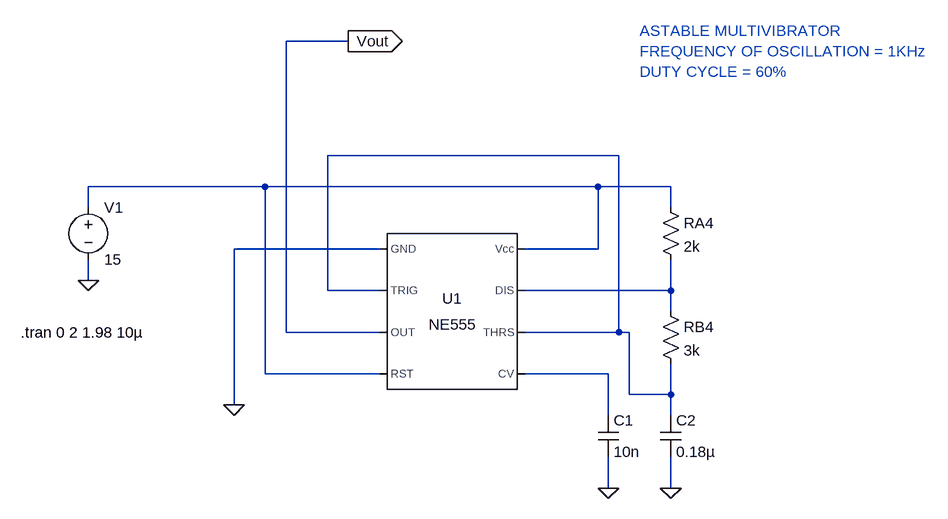
[diagram p0: schematic astable_multivibrator.asc]
astable_multivibrator.asc, the LTspice schematic file:
Version 4
SHEET 1 920 680
WIRE -32 -128 -128 -128
WIRE 384 48 -64 48
WIRE -160 96 -432 96
WIRE 352 96 -160 96
WIRE 464 96 352 96
WIRE -432 128 -432 96
WIRE 464 128 464 96
WIRE 16 192 -208 192
WIRE 352 192 352 96
WIRE 352 192 240 192
WIRE -432 240 -432 208
WIRE -64 256 -64 48
WIRE 16 256 -64 256
WIRE 464 256 464 208
WIRE 464 256 240 256
WIRE 464 288 464 256
WIRE -128 320 -128 -128
WIRE 16 320 -128 320
WIRE 384 320 384 48
WIRE 384 320 240 320
WIRE 400 320 384 320
WIRE -160 384 -160 96
WIRE 16 384 -160 384
WIRE 368 384 240 384
WIRE 400 416 400 320
WIRE 464 416 464 368
WIRE 464 416 400 416
WIRE -208 432 -208 192
WIRE 368 448 368 384
WIRE 464 448 464 416
WIRE 368 560 368 512
WIRE 464 560 464 512
FLAG -208 432 0
FLAG -432 240 0
FLAG 368 560 0
FLAG 464 560 0
FLAG -32 -128 Vout
IOPIN -32 -128 Out
SYMBOL NE555 128 288 R0
SYMATTR InstName U1
SYMBOL cap 352 448 R0
SYMATTR InstName C1
SYMATTR Value 10n
SYMBOL cap 448 448 R0
SYMATTR InstName C2
SYMATTR Value 0.18µ
SYMBOL res 448 112 R0
SYMATTR InstName RA4
SYMATTR Value 2k
SYMBOL res 448 272 R0
SYMATTR InstName RB4
SYMATTR Value 3k
SYMBOL voltage -432 112 R0
WINDOW 123 0 0 Left 0
WINDOW 39 0 0 Left 0
SYMATTR InstName V1
SYMATTR Value 15
TEXT -536 320 Left 2 !.tran 0 2 1.98 10µ
TEXT 416 -144 Left 2 ;ASTABLE MULTIVIBRATOR\nFREQUENCY OF OSCILLATION = 1KHz\nDUTY CYCLE = 60%

The netlist it stands for:
* astable_multivibrator.asc
XU1 0 N001 Vout N002 N004 N001 N003 N002 NE555  ; pins GND TRIG OUT RST CV THRS DIS Vcc
C1 N004 0 10n
C2 N001 0 0.18µ
RA4 N002 N003 2k
RB4 N003 N001 3k
V1 N002 0 15
.tran 0 2 1.98 10µ
* ASTABLE MULTIVIBRATOR
* FREQUENCY OF OSCILLATION = 1KHz
* DUTY CYCLE = 60%
.lib NE555.sub
.backanno
.end